# Altium schematic sheet Delay.SchDoc (part 2 of 4)
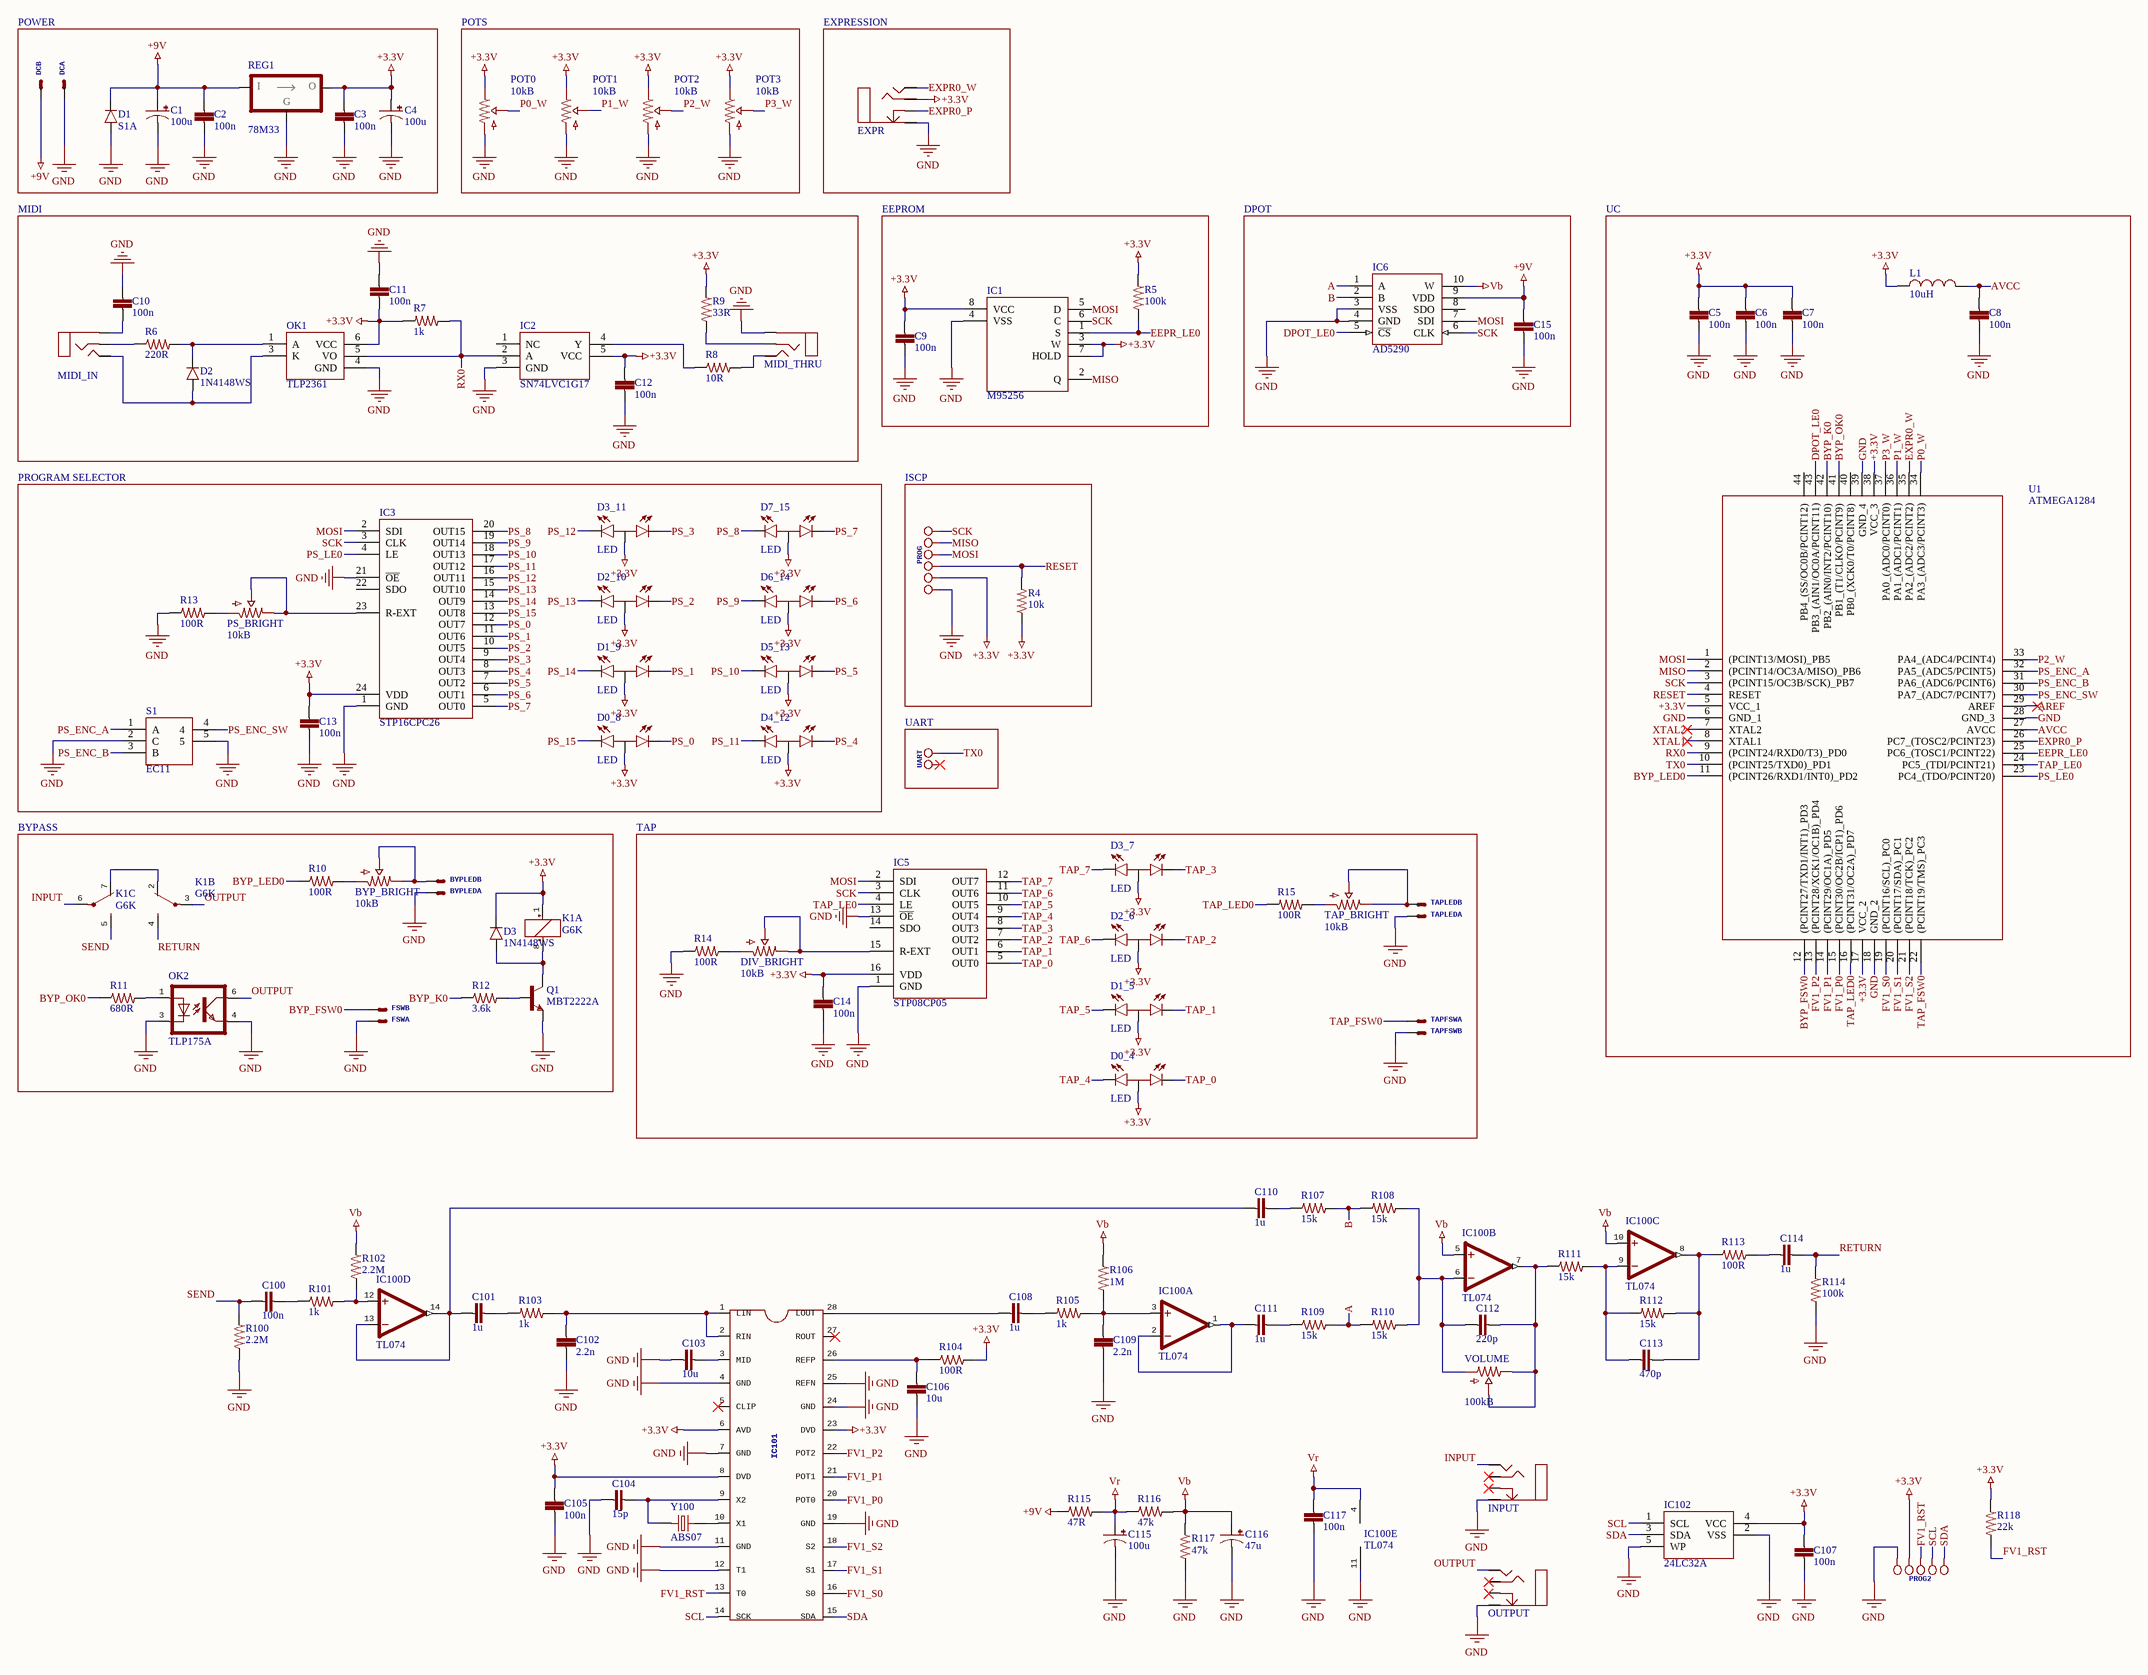
[diagram p1: Delay.SchDoc]
## Library data of the parts
BYP_BRIGHT DIV_BRIGHT PS_BRIGHT TAP_BRIGHT = TRIM_10kB_3362P: 10k Lin 3362P trimmer; Price: 0.1
BYPLED FSW TAPFSW TAPLED = JST-XH-02: 2 Pins male XH header; Price: 0.1
C1 C4 C115 = MCVVT025M101EA6L: CAP ALUM 100UF 25V SMD; Manufacturer: Multicomp; Life (Hours): 2000Hour; Ripple Current (AC): 6.3mA; Supplier 1: Farnell; Supplier Part Number 1: 2611370; Manufacturer Part Number: MCVVT025M101EA6L; Stock: 1063; Pricing: 1=0.157, 50=0.104, 100=0.0932, 250=0.0801, 500=0.0681 (EUR); RoHS: No; Min Operating Temperature: -55°C; Max Operating Temperature: 105°C; Capacitance: 100uF; Voltage Rating: 25V; Packaging: Tape and Reel; Voltage Rating (DC): 25V; Diameter: 6.3mm; Height: 7.7mm; REACH SVHC: No SVHC; ComponentLink1URL: http://www.farnell.com/datasheets/2151198.pdf?src-supplier=Element14; ComponentLink1Description: http://www.farnell.com/datasheets/2151198.pdf?src-supplier=Element14; Price: 0.102
C2 C3 C5-C15 C105 C107 C117 = MC0603B104K500CT: CAP CER 100NF 50V X7R 0603; Manufacturer: Multicomp; Tolerance: 10%; Supplier 1: Farnell; Supplier Part Number 1: 1759122; Manufacturer Part Number: MC0603B104K500CT; Stock 1: 1057763; RoHS: Yes; Case/Package: 0603; Number of Pins: 2; Case Code (Metric): 1608; Case Code (Imperial): 0603; Min Operating Temperature: -55°C; Max Operating Temperature: 125°C; Packaging: Cut Tape; Voltage Rating: 50V; Capacitance: 100nF; Dielectric: X7R; Voltage Rating (DC): 50V; REACH SVHC: Unknown; ComponentLink1URL: https://datasheet.ciiva.com/22686/1901289-22686278.pdf?src-supplier=Element14; ComponentLink1Description: https://datasheet.ciiva.com/22686/1901289-22686278.pdf?src-supplier=Element14; ComponentLink2URL: https://datasheet.ciiva.com/22686/1901289-22686279.pdf?src-supplier=Element14; ComponentLink2Description: https://datasheet.ciiva.com/22686/1901289-22686279.pdf?src-supplier=Element14; ComponentLink3URL: https://datasheet.ciiva.com/22648/1901289-22648411.pdf?src-supplier=Element14; ComponentLink3Description: https://datasheet.ciiva.com/22648/1901289-22648411.pdf?src-supplier=Element14; Price: 0.0458
C100 = GRM31C5C1H104JA01L: CAP CER 100NF 50V C0G/NP0 1206; Manufacturer: Murata; Material: Ceramic; Tolerance: 5%; Dielectric: C0G; Temperature Coefficient: 30ppm/°C; Supplier 1: Farnell; Supplier Part Number 1: 2494294; Manufacturer Part Number: GRM31C5C1H104JA01L; Stock 1: 206865; Pricing 1: 5 = 0.62500, 50 = 0.31000, 250 = 0.29700, 500 = 0.22200, 1000 = 0.18900 (EUR); RoHS: Yes; Mount: Surface Mount; Case/Package: 1206; Weight: 0.000571oz; Case Code (Metric): 3216; Case Code (Imperial): 1206; Min Operating Temperature: -55°C; Max Operating Temperature: 125°C; Capacitance: 100nF; Packaging: Tape and Reel; Package Quantity: 1; Voltage Rating: 50V; Voltage Rating (DC): 50V; Termination: SMD/SMT; Voltage: 50V; Length: 3.2mm; Height: 1.6mm; Width: 0.063inch; Thickness: 0.071inch; Depth: 1.6mm; Radiation Hardening: No; REACH SVHC: No SVHC; Lead Free: Lead Free; ComponentLink1URL: https://datasheet.ciiva.com/11618/product-11618880.pdf?src-supplier=Avnet; ComponentLink1Description: https://datasheet.ciiva.com/11618/product-11618880.pdf?src-supplier=Avnet; ComponentLink2URL: https://datasheet.ciiva.com/29200/453430-da-01-en-vs-kondensator-1206-29200201.pdf?src-supplier=Conrad; ComponentLink2Description: https://datasheet.ciiva.com/29200/453430-da-01-en-vs-kondensator-1206-29200201.pdf?src-supplier=Conrad; ComponentLink3URL: https://datasheet.ciiva.com/5420/product-5420070.pdf?src-supplier=Mouser; ComponentLink3Description: https://datasheet.ciiva.com/5420/product-5420070.pdf?src-supplier=Mouser; ComponentLink4URL: https://datasheet.ciiva.com/16461/product-16461275.pdf?src-supplier=Future+Electronics; ComponentLink4Description: https://datasheet.ciiva.com/16461/product-16461275.pdf?src-supplier=Future+Electronics; ComponentLink5URL: https://datasheet.ciiva.com/6270/partnumbering-e-01-6270255.pdf?src-supplier=Digi-Key; ComponentLink5Description: https://datasheet.ciiva.com/6270/partnumbering-e-01-6270255.pdf?src-supplier=Digi-Key; Price: 0.31
C101 C108 C110 C111 C114 = ECP-U1C105MA5: CAP FILM 1UF 16V 20%; Manufacturer: Panasonic; Dielectric: PPS; Dissipation Factor: 1.5%; Insulation Resistance: 300MR; Supplier 1: Farnell; Supplier Part Number 1: 9694315; Manufacturer Part Number: ECP-U1C105MA5; RoHS: Yes; Category: Film Capacitors; Stock: 7744; Pricing: 5=0.65900, 50=0.39900, 250=0.33300, 500=0.27300, 1000=0.26400 (EUR); Mount: Surface Mount; Case/Package: 1210; Number of Pins: 2; Case Code (Metric): 3225; Contact Plating: Copper,Tin,Silver; Case Code (Imperial): 1210; Min Operating Temperature: -40°C; Max Operating Temperature: 85°C; Capacitance: 1uF; Tolerance: 20%; Termination: SMD/SMT; Voltage: 16V; Packaging: Tape and Reel; Package Quantity: 1; Voltage Rating: 16V; Voltage Rating (DC): 16V; Length: 3.2mm; Height: 1.4mm; Depth: 2.5mm; Height - Seated (Max): 0.063inch; Width: 2.5mm; Radiation Hardening: No; Lead Free: Lead Free; REACH SVHC: No SVHC; ComponentLink1URL: https://datasheet.ciiva.com/24023/abd0000ce12-181823-24023616.pdf?src-supplier=Mouser; ComponentLink1Description: https://datasheet.ciiva.com/24023/abd0000ce12-181823-24023616.pdf?src-supplier=Mouser; ComponentLink2URL: https://datasheet.ciiva.com/34303/1983192-34303533.pdf?src-supplier=Jameco; ComponentLink2Description: https://datasheet.ciiva.com/34303/1983192-34303533.pdf?src-supplier=Jameco; ComponentLink3URL: https://datasheet.ciiva.com/11790/0900766b80f2ea72-11790686.pdf?src-supplier=RSComponents; ComponentLink3Description: https://datasheet.ciiva.com/11790/0900766b80f2ea72-11790686.pdf?src-supplier=RSComponents; ComponentLink4URL: https://datasheet.ciiva.com/2992/abd0000ce12-2992994.pdf?src-supplier=Avnet; ComponentLink4Description: https://datasheet.ciiva.com/2992/abd0000ce12-2992994.pdf?src-supplier=Avnet; ComponentLink5URL: https://datasheet.ciiva.com/2992/abd0000ce12-2992995.pdf?src-supplier=Avnet; ComponentLink5Description: https://datasheet.ciiva.com/2992/abd0000ce12-2992995.pdf?src-supplier=Avnet; ComponentLink6URL: https://datasheet.ciiva.com/46399/31740-46399788.pdf?src-supplier=Element14; ComponentLink6Description: https://datasheet.ciiva.com/46399/31740-46399788.pdf?src-supplier=Element14; ComponentLink7URL: https://datasheet.ciiva.com/16433/abd0000ce12-16433502.pdf?src-supplier=Future+Electronics; ComponentLink7Description: https://datasheet.ciiva.com/16433/abd0000ce12-16433502.pdf?src-supplier=Future+Electronics; ComponentLink8URL: https://datasheet.ciiva.com/5710/31740-5710134.pdf?src-supplier=Farnell; ComponentLink8Description: https://datasheet.ciiva.com/5710/31740-5710134.pdf?src-supplier=Farnell; ComponentLink9URL: https://datasheet.ciiva.com/30120/abd0000ce12-30120298.pdf?src-supplier=Onlinecomponents.com; ComponentLink9Description: https://datasheet.ciiva.com/30120/abd0000ce12-30120298.pdf?src-supplier=Onlinecomponents.com; ComponentLink10URL: https://datasheet.ciiva.com/46399/31740-46399787.pdf?src-supplier=Element14; ComponentLink10Description: https://datasheet.ciiva.com/46399/31740-46399787.pdf?src-supplier=Element14; ComponentLink11URL: https://datasheet.ciiva.com/15164/getdatasheetpartid-292104-15164029.pdf?src-supplier=Verical; ComponentLink11Description: https://datasheet.ciiva.com/15164/getdatasheetpartid-292104-15164029.pdf?src-supplier=Verical
C102 C109 = GRM1885C1H222JA01D: CAP CER 2.2NF 50V C0G/NP0 0603; Manufacturer: Murata; Material: Ceramic; Tolerance: 5%; Dielectric: C0G; Insulation Resistance: 10GR; Temperature Coefficient: 30ppm/°C; Supplier 1: Farnell; Supplier Part Number 1: 8819947; Manufacturer Part Number: GRM1885C1H222JA01D; Stock 1: 81117; Pricing 1: 10 = 0.11000, 100 = 0.05180, 500 = 0.04100, 1000 = 0.03510, 2000 = 0.03080 (EUR); RoHS: Yes; Mount: Surface Mount; Case/Package: 0603; Number of Pins: 2; Case Code (Imperial): 0603; Case Code (Metric): 1608; Dielectric Material: Ceramic; Min Operating Temperature: -55°C; Max Operating Temperature: 125°C; Capacitance: 2.2nF; Packaging: Tape and Reel; Voltage Rating: 50V; Voltage Rating (DC): 50V; Package Quantity: 1; Termination: SMD/SMT; Voltage: 50V; Length: 1.6mm; Height: 0.8mm; Width: 0.8mm; Thickness: 0.035inch; Depth: 0.8mm; Radiation Hardening: No; REACH SVHC: No SVHC; Lead Free: Lead Free; ComponentLink1URL: https://datasheet.ciiva.com/11786/0900766b807a1cab-11786840.pdf?src-supplier=RSComponents; ComponentLink1Description: https://datasheet.ciiva.com/11786/0900766b807a1cab-11786840.pdf?src-supplier=RSComponents; ComponentLink2URL: https://datasheet.ciiva.com/3777/1632grm1885c1h222ja0123-3777835.pdf?src-supplier=Arrow; ComponentLink2Description: https://datasheet.ciiva.com/3777/1632grm1885c1h222ja0123-3777835.pdf?src-supplier=Arrow; ComponentLink3URL: https://datasheet.ciiva.com/2989/product-2989459.pdf?src-supplier=Avnet; ComponentLink3Description: https://datasheet.ciiva.com/2989/product-2989459.pdf?src-supplier=Avnet; ComponentLink4URL: https://datasheet.ciiva.com/6031/4360-6031797.pdf?src-supplier=Farnell; ComponentLink4Description: https://datasheet.ciiva.com/6031/4360-6031797.pdf?src-supplier=Farnell; ComponentLink5URL: https://datasheet.ciiva.com/7828/4360-7828918.pdf?src-supplier=Element14; ComponentLink5Description: https://datasheet.ciiva.com/7828/4360-7828918.pdf?src-supplier=Element14; ComponentLink6URL: https://datasheet.ciiva.com/11463/product-11463974.pdf?src-supplier=Avnet; ComponentLink6Description: https://datasheet.ciiva.com/11463/product-11463974.pdf?src-supplier=Avnet; ComponentLink7URL: https://datasheet.ciiva.com/16624/product-16624150.pdf?src-supplier=Avnet+Europe; ComponentLink7Description: https://datasheet.ciiva.com/16624/product-16624150.pdf?src-supplier=Avnet+Europe; ComponentLink8URL: https://datasheet.ciiva.com/7828/1747455-7828919.pdf?src-supplier=Element14; ComponentLink8Description: https://datasheet.ciiva.com/7828/1747455-7828919.pdf?src-supplier=Element14; ComponentLink9URL: https://datasheet.ciiva.com/133/partnumbering-e-01-133576.pdf?src-supplier=Digi-Key; ComponentLink9Description: https://datasheet.ciiva.com/133/partnumbering-e-01-133576.pdf?src-supplier=Digi-Key; ComponentLink10URL: https://datasheet.ciiva.com/7828/1747455-7828920.pdf?src-supplier=Element14; ComponentLink10Description: https://datasheet.ciiva.com/7828/1747455-7828920.pdf?src-supplier=Element14; ComponentLink11URL: https://datasheet.ciiva.com/133/partnumbering-e-01-133577.pdf?src-supplier=Digi-Key; ComponentLink11Description: https://datasheet.ciiva.com/133/partnumbering-e-01-133577.pdf?src-supplier=Digi-Key; ComponentLink12URL: https://datasheet.ciiva.com/133/partnumbering-e-01-133578.pdf?src-supplier=Digi-Key; ComponentLink12Description: https://datasheet.ciiva.com/133/partnumbering-e-01-133578.pdf?src-supplier=Digi-Key; ComponentLink13URL: https://datasheet.ciiva.com/29241/450664-da-01-en-vs-kondensator-0603-29241770.pdf?src-supplier=Conrad; ComponentLink13Description: https://datasheet.ciiva.com/29241/450664-da-01-en-vs-kondensator-0603-29241770.pdf?src-supplier=Conrad; Price: 0.0217
C103 C106 = TMK316B7106KL-TD: CAP CER 10uF 25V X7R 1206; Manufacturer: Taiyo Yuden; Tolerance: 10%; Supplier 1: Farnell; Supplier Part Number 1: 2113073; Manufacturer Part Number: TMK316B7106KL-TD; RoHS: Yes; Category: Ceramic Capacitors; Stock: 588931; Mount: Surface Mount; Case/Package: 1206; Number of Pins: 2; Case Code (Imperial): 1206; Case Code (Metric): 3216; Weight: 0.000571oz; Min Operating Temperature: -55°C; Max Operating Temperature: 125°C; Capacitance: 10uF; Voltage Rating: 25V; Packaging: Tape and Reel; Dielectric: X7R; Voltage Rating (DC): 25V; Package Quantity: 1; Termination: SMD/SMT; Resistor Type: Ceramic; Length: 0.126inch; Width: 1.6mm; Height: 1.6mm; Thickness: 0.071inch; REACH SVHC: Unknown; ComponentLink1URL: https://datasheet.ciiva.com/15922/582tmk316ab7106kl-t-15922403.pdf?src-supplier=Onlinecomponents.com; ComponentLink1Description: https://datasheet.ciiva.com/15922/582tmk316ab7106kl-t-15922403.pdf?src-supplier=Onlinecomponents.com; ComponentLink2URL: https://datasheet.ciiva.com/7975/1784422-7975593.pdf?src-supplier=Element14; ComponentLink2Description: https://datasheet.ciiva.com/7975/1784422-7975593.pdf?src-supplier=Element14; ComponentLink3URL: https://datasheet.ciiva.com/30123/25tmk316ab7106kl-t-30123726.pdf?src-supplier=Onlinecomponents.com; ComponentLink3Description: https://datasheet.ciiva.com/30123/25tmk316ab7106kl-t-30123726.pdf?src-supplier=Onlinecomponents.com; ComponentLink4URL: https://datasheet.ciiva.com/7975/mlcc-all-e-7975834.pdf?src-supplier=Element14; ComponentLink4Description: https://datasheet.ciiva.com/7975/mlcc-all-e-7975834.pdf?src-supplier=Element14; ComponentLink5URL: https://datasheet.ciiva.com/139/mlcc-all-e-139531.pdf?src-supplier=Digi-Key; ComponentLink5Description: https://datasheet.ciiva.com/139/mlcc-all-e-139531.pdf?src-supplier=Digi-Key; ComponentLink6URL: https://datasheet.ciiva.com/22748/1481447-22748971.pdf?src-supplier=Element14; ComponentLink6Description: https://datasheet.ciiva.com/22748/1481447-22748971.pdf?src-supplier=Element14; ComponentLink7URL: https://datasheet.ciiva.com/139/mlcc-all-e-139532.pdf?src-supplier=Digi-Key; ComponentLink7Description: https://datasheet.ciiva.com/139/mlcc-all-e-139532.pdf?src-supplier=Digi-Key; ComponentLink8URL: https://datasheet.ciiva.com/139/mlcc-all-e-139533.pdf?src-supplier=Digi-Key; ComponentLink8Description: https://datasheet.ciiva.com/139/mlcc-all-e-139533.pdf?src-supplier=Digi-Key; Price: 0.149
C104 = MC0603N150J500CT: CAP CER 15PF 50V C0G/NP0 0603; Manufacturer: Multicomp; Tolerance: 5%; Dielectric: C0G; Temperature Coefficient: 30ppm/°C; Supplier 1: Farnell; Supplier Part Number 1: 1759055; Manufacturer Part Number: MC0603N150J500CT; RoHS: Yes; Category: Ceramic Capacitors; Stock: 62089; Pricing: 10=0.04660, 100=0.03490, 500=0.02000, 1000=0.01400, 2000=0.01240 (EUR); Case/Package: 0603; Number of Pins: 2; Case Code (Metric): 1608; Case Code (Imperial): 0603; Min Operating Temperature: -55°C; Max Operating Temperature: 125°C; Capacitance: 15pF; Packaging: Tape and Reel; Voltage Rating: 50V; Voltage Rating (DC): 50V; Width: 0.8mm; REACH SVHC: Unknown; ComponentLink1URL: https://datasheet.ciiva.com/22675/1901289-22675815.pdf?src-supplier=Element14; ComponentLink1Description: https://datasheet.ciiva.com/22675/1901289-22675815.pdf?src-supplier=Element14; ComponentLink2URL: https://datasheet.ciiva.com/22675/1901289-22675816.pdf?src-supplier=Element14; ComponentLink2Description: https://datasheet.ciiva.com/22675/1901289-22675816.pdf?src-supplier=Element14; ComponentLink3URL: https://datasheet.ciiva.com/22648/1901289-22648477.pdf?src-supplier=Element14; ComponentLink3Description: https://datasheet.ciiva.com/22648/1901289-22648477.pdf?src-supplier=Element14; Price: 0.0356
C112 = MC0603N221J500CT: CAP CER 220PF 50V C0G/NP0 0603; Manufacturer: Multicomp; Tolerance: 5%; Dielectric: C0G; Supplier 1: Farnell; Supplier Part Number 1: 1759071; Manufacturer Part Number: MC0603N221J500CT; Stock: 17812; Pricing: 10=0.027, 100=0.0219, 500=0.0135, 1000=0.0107, 2000=0.0098 (EUR); RoHS: Yes; Case/Package: 0603; Number of Pins: 2; Case Code (Metric): 1608; Case Code (Imperial): 0603; Min Operating Temperature: -55°C; Max Operating Temperature: 125°C; Capacitance: 220pF; Packaging: Cut Tape; Voltage Rating: 50V; Voltage Rating (DC): 50V; REACH SVHC: Unknown; ComponentLink1URL: https://datasheet.ciiva.com/22648/1901289-22648489.pdf?src-supplier=Element14; ComponentLink1Description: https://datasheet.ciiva.com/22648/1901289-22648489.pdf?src-supplier=Element14; ComponentLink2URL: https://datasheet.ciiva.com/22675/1901289-22675354.pdf?src-supplier=Element14; ComponentLink2Description: https://datasheet.ciiva.com/22675/1901289-22675354.pdf?src-supplier=Element14; ComponentLink3URL: https://datasheet.ciiva.com/22675/1901289-22675355.pdf?src-supplier=Element14; ComponentLink3Description: https://datasheet.ciiva.com/22675/1901289-22675355.pdf?src-supplier=Element14; Price: 0.0192
C113 = MC0603N471J500CT: CAP CER 470PF 50V C0G/NP0 0603; Manufacturer: Multicomp; Tolerance: 5%; Dielectric: C0G; Temperature Coefficient: 30ppm/°C; Supplier 1: Farnell; Supplier Part Number 1: 1759080; Manufacturer Part Number: MC0603N471J500CT; Stock: 33267; Pricing: 10=0.0522, 100=0.0354, 500=0.0206, 1000=0.0189, 2000=0.0171 (EUR); RoHS: Yes; Case/Package: 0603; Number of Pins: 2; Case Code (Metric): 1608; Case Code (Imperial): 0603; Min Operating Temperature: -55°C; Max Operating Temperature: 125°C; Capacitance: 470pF; Voltage Rating: 50V; Packaging: Cut Tape; Voltage Rating (DC): 50V; Width: 0.8mm; REACH SVHC: Unknown; ComponentLink1URL: https://datasheet.ciiva.com/22648/1901289-22648504.pdf?src-supplier=Element14; ComponentLink1Description: https://datasheet.ciiva.com/22648/1901289-22648504.pdf?src-supplier=Element14; ComponentLink2URL: https://datasheet.ciiva.com/22675/1901289-22675320.pdf?src-supplier=Element14; ComponentLink2Description: https://datasheet.ciiva.com/22675/1901289-22675320.pdf?src-supplier=Element14; ComponentLink3URL: https://datasheet.ciiva.com/22648/1901289-22648505.pdf?src-supplier=Element14; ComponentLink3Description: https://datasheet.ciiva.com/22648/1901289-22648505.pdf?src-supplier=Element14; Price: 0.035
C116 = MCVVT025M470EA1L: CAP ALUM 47UF 25V SMD; Manufacturer: Multicomp; Life (Hours): 2000Hour; Ripple Current (AC): 6.3mA; Supplier 1: Farnell; Supplier Part Number 1: 2611377; Manufacturer Part Number: MCVVT025M470EA1L; Stock: 1436; Pricing: 1=0.125, 50=0.0825, 100=0.0741, 250=0.0637, 500=0.0542 (EUR); RoHS: No; Min Operating Temperature: -55°C; Max Operating Temperature: 105°C; Capacitance: 47uF; Voltage Rating: 25V; Packaging: Cut Tape; Voltage Rating (DC): 25V; Diameter: 6.3mm; Height: 5.4mm; REACH SVHC: No SVHC; ComponentLink1URL: http://www.farnell.com/datasheets/2151198.pdf?src-supplier=Farnell; ComponentLink1Description: http://www.farnell.com/datasheets/2151198.pdf?src-supplier=Farnell; ComponentLink2URL: http://www.farnell.com/datasheets/2151198.pdf?src-supplier=Element14; ComponentLink2Description: http://www.farnell.com/datasheets/2151198.pdf?src-supplier=Element14; Price: 0.0825
D0_4 D0_8 D1_5 D1_9 D2_6 D2_10 D3_7 D3_11 D4_12 D5_13 D6_14 D7_15 = D_BICOLOR_LED: BICOLOR LED
D1 = S1A: DIODE GEN PURP 50V 1A SMA; Manufacturer: ON Semiconductor / Fairchild; Peak Reverse Current: 1uA; Max Surge Current: 40A; Forward Voltage: 1.1V; Peak Non-Repetitive Surge Current: 30A; Element Configuration: Single; Capacitance: 12pF; Recovery Time: 1800ns; Reverse Recovery Time: 1.8us; Polarity: Standard; Power Dissipation: 1.4W; Supplier 1: Farnell; Supplier Part Number 1: 9843868; Manufacturer Part Number: S1A; Stock: 34555; Pricing: 5=0.184, 25=0.179, 100=0.0727, 250=0.0669, 500=0.0667, 1000=0.0364, 5000=0.0293 (EUR); RoHS: Yes; Mount: Surface Mount; Case/Package: SMA; Number of Pins: 2; Weight: 0.106g; Contact Plating: Tin; Min Operating Temperature: -55°C; Max Operating Temperature: 150°C; Packaging: Tape and Reel; Package Quantity: 1; Voltage Rating (DC): 50V; Current Rating: 1A; Output Current: 1A; Forward Current: 1A; Max Repetitive Reverse Voltage (Vrrm): 50V; Average Rectified Current: 1A; Max Forward Surge Current (Ifsm): 30A; Max Reverse Voltage (DC): 50V; Reverse Voltage: 50V; Width: 5.28mm; Radiation Hardening: No; REACH SVHC: No SVHC; Lead Free: Lead Free; ComponentLink1URL: https://datasheet.ciiva.com/910/s1a-910480.pdf?src-supplier=Avnet; ComponentLink1Description: https://datasheet.ciiva.com/910/s1a-910480.pdf?src-supplier=Avnet; ComponentLink2URL: https://datasheet.ciiva.com/23683/1730038-23683616.pdf?src-supplier=Newark; ComponentLink2Description: https://datasheet.ciiva.com/23683/1730038-23683616.pdf?src-supplier=Newark; ComponentLink3URL: https://datasheet.ciiva.com/4452/s1a-191336-4452662.pdf?src-supplier=Mouser; ComponentLink3Description: https://datasheet.ciiva.com/4452/s1a-191336-4452662.pdf?src-supplier=Mouser; ComponentLink4URL: https://datasheet.ciiva.com/25624/0900766b80f9b629-25624903.pdf?src-supplier=RSComponents; ComponentLink4Description: https://datasheet.ciiva.com/25624/0900766b80f9b629-25624903.pdf?src-supplier=RSComponents; ComponentLink5URL: https://datasheet.ciiva.com/916/s1a-916898.pdf?src-supplier=Digi-Key; ComponentLink5Description: https://datasheet.ciiva.com/916/s1a-916898.pdf?src-supplier=Digi-Key; ComponentLink6URL: https://datasheet.ciiva.com/916/s1a-916899.pdf?src-supplier=Digi-Key; ComponentLink6Description: https://datasheet.ciiva.com/916/s1a-916899.pdf?src-supplier=Digi-Key; ComponentLink7URL: https://datasheet.ciiva.com/916/s1a-916900.pdf?src-supplier=Digi-Key; ComponentLink7Description: https://datasheet.ciiva.com/916/s1a-916900.pdf?src-supplier=Digi-Key; ComponentLink8URL: https://datasheet.ciiva.com/16800/s1a-16800103.pdf?src-supplier=Future+Electronics; ComponentLink8Description: https://datasheet.ciiva.com/16800/s1a-16800103.pdf?src-supplier=Future+Electronics; ComponentLink9URL: https://datasheet.ciiva.com/28469/1766308-28469031.pdf?src-supplier=Element14; ComponentLink9Description: https://datasheet.ciiva.com/28469/1766308-28469031.pdf?src-supplier=Element14; ComponentLink10URL: https://datasheet.ciiva.com/26231/s1k-26231832.pdf?src-supplier=Avnet+Europe; ComponentLink10Description: https://datasheet.ciiva.com/26231/s1k-26231832.pdf?src-supplier=Avnet+Europe; ComponentLink11URL: https://datasheet.ciiva.com/16474/s1k-16474283.pdf?src-supplier=Avnet+Asia; ComponentLink11Description: https://datasheet.ciiva.com/16474/s1k-16474283.pdf?src-supplier=Avnet+Asia; Price: 0.072
D2 D3 = 1N4148WS: DIODE GEN PURP 75V 150MA SOD323F; Manufacturer: ON Semiconductor / Fairchild; Element Configuration: Single; Reverse Recovery Time: 4ns; Forward Voltage: 1V; Peak Reverse Current: 5uA; Power Dissipation: 200mW; Max Forward Surge Current (Ifsm): 2A; Supplier 1: Farnell; Supplier Part Number 1: 2453269; Manufacturer Part Number: 1N4148WS; Stock: 379338; Pricing: 5=0.155, 25=0.151, 100=0.0529, 250=0.0498, 500=0.0477, 1000=0.0243, 5000=0.0193 (EUR); RoHS: Yes; Mount: Surface Mount; Number of Pins: 2; Weight: 0.0276g; Contact Plating: Tin; Min Operating Temperature: -55°C; Max Operating Temperature: 150°C; Forward Current: 150mA; Max Repetitive Reverse Voltage (Vrrm): 75V; Packaging: Tape and Reel; Package Quantity: 1; Average Rectified Current: 150mA; Max Reverse Voltage (DC): 75V; Recovery Time: 4ns; Reverse Voltage: 75V; Length: 1.8mm; Height: 1mm; Width: 1.35mm; Radiation Hardening: No; Lead Free: Lead Free; REACH SVHC: No SVHC; ComponentLink1URL: https://datasheet.ciiva.com/25968/1n914bws-25968945.pdf?src-supplier=Avnet+Europe; ComponentLink1Description: https://datasheet.ciiva.com/25968/1n914bws-25968945.pdf?src-supplier=Avnet+Europe; ComponentLink2URL: https://datasheet.ciiva.com/30479/0900766b810e1cd3-30479206.pdf?src-supplier=RSComponents; ComponentLink2Description: https://datasheet.ciiva.com/30479/0900766b810e1cd3-30479206.pdf?src-supplier=RSComponents; ComponentLink3URL: https://datasheet.ciiva.com/15208/getdatasheetpartid-127819-15208358.pdf?src-supplier=Verical; ComponentLink3Description: https://datasheet.ciiva.com/15208/getdatasheetpartid-127819-15208358.pdf?src-supplier=Verical; ComponentLink4URL: https://datasheet.ciiva.com/8300/1n914bws-8300360.pdf?src-supplier=Avnet; ComponentLink4Description: https://datasheet.ciiva.com/8300/1n914bws-8300360.pdf?src-supplier=Avnet; ComponentLink5URL: https://datasheet.ciiva.com/910/1n4148ws-910380.pdf?src-supplier=Digi-Key; ComponentLink5Description: https://datasheet.ciiva.com/910/1n4148ws-910380.pdf?src-supplier=Digi-Key; ComponentLink6URL: https://datasheet.ciiva.com/910/1n4148ws-910381.pdf?src-supplier=Digi-Key; ComponentLink6Description: https://datasheet.ciiva.com/910/1n4148ws-910381.pdf?src-supplier=Digi-Key; ComponentLink7URL: https://datasheet.ciiva.com/910/1n4148ws-910382.pdf?src-supplier=Digi-Key; ComponentLink7Description: https://datasheet.ciiva.com/910/1n4148ws-910382.pdf?src-supplier=Digi-Key; Price: 0.0521
DC = J_JST-XH-02: 2 Pins male XH header; Price: 0.1
EXPR INPUT OUTPUT = J_STEREO: 6.35mm stereo insulated socket jack PCB mounted; Price: 0.5
IC1 = M95256-WMN6P: IC EEPROM 256K SPI 20MHZ 8SO; Manufacturer: STMicroelectronics; Interface: SPI,Serial; Frequency: 5MHz; Access Time: 60ns; Density: 256Kb; Min Supply Voltage: 2.5V; Max Supply Voltage: 5.5V; Nominal Supply Current: 5mA; Supplier 1: Farnell; Supplier Part Number 1: 1099712; Manufacturer Part Number: M95256-WMN6P; RoHS: Yes; Category: EEPROM; Stock: 4109; Pricing: 1=0.63300, 50=0.55300, 100=0.49000, 250=0.48700, 500=0.48300, 1000=0.46600, 2500=0.38800, 5000=0.37200 (EUR); Mount: Surface Mount; Case/Package: SOIC; Number of Pins: 8; Contact Plating: Gold; Min Operating Temperature: -40°C; Max Operating Temperature: 85°C; Packaging: Rail/Tube; Memory Size: 256Kb; Max Frequency: 5MHz; Package Quantity: 100; Memory Type: EEPROM; Length: 5mm; Height: 1.5mm; Width: 4mm; Radiation Hardening: No; REACH SVHC: No SVHC; Lead Free: Lead Free; ComponentLink1URL: https://datasheet.ciiva.com/4859/cd00103810-224498-4859620.pdf?src-supplier=Mouser; ComponentLink1Description: https://datasheet.ciiva.com/4859/cd00103810-224498-4859620.pdf?src-supplier=Mouser; ComponentLink2URL: https://datasheet.ciiva.com/15123/getdatasheetpartid-42741-15123093.pdf?src-supplier=Verical; ComponentLink2Description: https://datasheet.ciiva.com/15123/getdatasheetpartid-42741-15123093.pdf?src-supplier=Verical; ComponentLink3URL: https://datasheet.ciiva.com/14163/m95256-w-eng-tds-14163003.pdf?src-supplier=Distrelec; ComponentLink3Description: https://datasheet.ciiva.com/14163/m95256-w-eng-tds-14163003.pdf?src-supplier=Distrelec; ComponentLink4URL: https://datasheet.ciiva.com/1905/cd00103810-1905381.pdf?src-supplier=Digi-Key; ComponentLink4Description: https://datasheet.ciiva.com/1905/cd00103810-1905381.pdf?src-supplier=Digi-Key; ComponentLink5URL: https://datasheet.ciiva.com/8055/1723939-8055206.pdf?src-supplier=Element14; ComponentLink5Description: https://datasheet.ciiva.com/8055/1723939-8055206.pdf?src-supplier=Element14; ComponentLink6URL: https://datasheet.ciiva.com/16622/cd00103810-16622983.pdf?src-supplier=Avnet+Europe; ComponentLink6Description: https://datasheet.ciiva.com/16622/cd00103810-16622983.pdf?src-supplier=Avnet+Europe; ComponentLink7URL: https://datasheet.ciiva.com/41455/001185592-da-01-en-ic-eepr-256kbit-m95256-wmn6p-soic-8-stm-41455210.pdf?src-supplier=Conrad; ComponentLink7Description: https://datasheet.ciiva.com/41455/001185592-da-01-en-ic-eepr-256kbit-m95256-wmn6p-soic-8-stm-41455210.pdf?src-supplier=Conrad; Price: 0.492
IC2 = SN74LVC1G17QDBVRQ1: Schmitt Trigger Buffer 1-CH Non-Inverting CMOS Automotive 5-Pin SOT-23 T/R; Manufacturer: Texas Instruments; Logic Function: Schmitt Trigger,Buffer; Max Supply Voltage: 5.5V; Min Supply Voltage: 1.65V; Propagation Delay: 8ns; Number of Channels: 1; Low Level Output Current: 32mA; High Level Output Current: -32mA; Turn-On Delay Time: 14ns; Quiescent Current: 20uA; Supplier 1: Farnell; Supplier Part Number 1: 2463773; Manufacturer Part Number: SN74LVC1G17QDBVRQ1; RoHS: Yes; Category: Logic Gates; Stock: 8770; Pricing: 5=0.23100, 50=0.17800, 100=0.12400, 250=0.10900, 500=0.09450, 1000=0.07980, 5000=0.07410 (EUR); Mount: Surface Mount; Case/Package: SOT-23-5; Number of Pins: 5; Min Operating Temperature: -40°C; Max Operating Temperature: 125°C; Polarity: Non-Inverting; Packaging: Tape and Reel; Package Quantity: 3000; Number of Outputs: 1; Number of Elements: 1; Number of Bits per Element: 1; Number of Bits: 1; Number of Inputs: 1; Number of Input Lines: 1; Number of Output Lines: 1; Radiation Hardening: No; REACH SVHC: No SVHC; Lead Free: Lead Free; ComponentLink1URL: https://datasheet.ciiva.com/26220/sn74lvc1g17-q1-26220672.pdf?src-supplier=Avnet+Europe; ComponentLink1Description: https://datasheet.ciiva.com/26220/sn74lvc1g17-q1-26220672.pdf?src-supplier=Avnet+Europe; ComponentLink2URL: https://datasheet.ciiva.com/6623/sn74lvc1g17-q1-6623803.pdf?src-supplier=Digi-Key; ComponentLink2Description: https://datasheet.ciiva.com/6623/sn74lvc1g17-q1-6623803.pdf?src-supplier=Digi-Key; ComponentLink3URL: https://datasheet.ciiva.com/6623/sn74lvc1g17-q1-6623805.pdf?src-supplier=Digi-Key; ComponentLink3Description: https://datasheet.ciiva.com/6623/sn74lvc1g17-q1-6623805.pdf?src-supplier=Digi-Key; ComponentLink4URL: https://datasheet.ciiva.com/14318/sces663a-14318069.pdf?src-supplier=Avnet; ComponentLink4Description: https://datasheet.ciiva.com/14318/sces663a-14318069.pdf?src-supplier=Avnet; ComponentLink5URL: https://datasheet.ciiva.com/46442/1840260-46442070.pdf?src-supplier=Element14; ComponentLink5Description: https://datasheet.ciiva.com/46442/1840260-46442070.pdf?src-supplier=Element14; ComponentLink6URL: https://datasheet.ciiva.com/6623/sn74lvc1g17-q1-6623804.pdf?src-supplier=Digi-Key; ComponentLink6Description: https://datasheet.ciiva.com/6623/sn74lvc1g17-q1-6623804.pdf?src-supplier=Digi-Key; Price: 0.165
IC3 = STP16CPC26MTR: IC LED DRIVER LIN DIM 90MA 24SO; Manufacturer: STMicroelectronics; Output Voltage: 20V; Max Supply Voltage: 5.5V; Min Supply Voltage: 3V; Number of Outputs: 16; Frequency: 30MHz; Max Supply Current: 15.3mA; Supplier 1: Farnell; Supplier Part Number 1: 2460710; Manufacturer Part Number: STP16CPC26MTR; RoHS: Yes; Category: LED Drivers; Stock: 1485; Pricing: 1=1.00000, 25=0.87800, 50=0.77600, 100=0.67400, 250=0.63500, 500=0.59600, 1000=0.50900, 2500=0.42200 (EUR); Mount: Surface Mount; Case/Package: SOIC; Number of Pins: 24; Min Operating Temperature: -40°C; Max Operating Temperature: 125°C; Packaging: Tape and Reel; Package Quantity: 1; Output Current: 90mA; Min Input Voltage: 3V; Max Input Voltage: 5.5V; Switching Frequency: 30MHz; Output Current per Channel: 90mA; Radiation Hardening: No; REACH SVHC: No SVHC; Lead Free: Lead Free; ComponentLink1URL: https://datasheet.ciiva.com/41458/001184648-da-01-en-ic-led-sink-dv-stp16cpc26mtr-soic-24-stm-41458200.pdf?src-supplier=Conrad; ComponentLink1Description: https://datasheet.ciiva.com/41458/001184648-da-01-en-ic-led-sink-dv-stp16cpc26mtr-soic-24-stm-41458200.pdf?src-supplier=Conrad; ComponentLink2URL: https://datasheet.ciiva.com/1947/cd00298756-1947651.pdf?src-supplier=Digi-Key; ComponentLink2Description: https://datasheet.ciiva.com/1947/cd00298756-1947651.pdf?src-supplier=Digi-Key; ComponentLink3URL: https://datasheet.ciiva.com/1947/cd00298756-1947652.pdf?src-supplier=Digi-Key; ComponentLink3Description: https://datasheet.ciiva.com/1947/cd00298756-1947652.pdf?src-supplier=Digi-Key; ComponentLink4URL: https://datasheet.ciiva.com/1947/cd00298756-1947653.pdf?src-supplier=Digi-Key; ComponentLink4Description: https://datasheet.ciiva.com/1947/cd00298756-1947653.pdf?src-supplier=Digi-Key; ComponentLink5URL: https://datasheet.ciiva.com/16491/cd00298756-16491784.pdf?src-supplier=Future+Electronics; ComponentLink5Description: https://datasheet.ciiva.com/16491/cd00298756-16491784.pdf?src-supplier=Future+Electronics; ComponentLink6URL: https://datasheet.ciiva.com/3165/cd00298756-3165289.pdf?src-supplier=Avnet; ComponentLink6Description: https://datasheet.ciiva.com/3165/cd00298756-3165289.pdf?src-supplier=Avnet; ComponentLink7URL: https://datasheet.ciiva.com/17015/cd00298756-17015228.pdf?src-supplier=Avnet+Europe; ComponentLink7Description: https://datasheet.ciiva.com/17015/cd00298756-17015228.pdf?src-supplier=Avnet+Europe; Price: 1.09
IC5 = STP08CP05MTR: IC SHIFT REGISTER 8BIT 16SOIC; Manufacturer: STMicroelectronics; Max Supply Voltage: 5.5V; Min Supply Voltage: 3V; Number of Outputs: 8; Number of Elements: 1; Propagation Delay: 28ns; Nominal Supply Current: 13.5mA; Output Voltage: 20V; Number of Output Lines: 9; Output Current per Channel: 100mA; Switching Frequency: 30MHz; Supplier 1: Farnell; Supplier Part Number 1: 2460704; Manufacturer Part Number: STP08CP05MTR; RoHS: Yes; Category: Shift Registers; Stock: 5551; Pricing: 1=0.78800, 50=0.68900, 100=0.44400, 250=0.41500, 500=0.38500, 1000=0.35600, 2500=0.30100, 5000=0.28900 (EUR); Mount: Surface Mount; Case/Package: SO; Number of Pins: 16; Contact Plating: Gold; Min Operating Temperature: -40°C; Max Operating Temperature: 125°C; Packaging: Tape and Reel; Package Quantity: 1; Number of Bits per Element: 8; Logic Function: Shift Register; Number of Circuits: 1; Number of Input Lines: 1; Output Current: 100mA; Min Input Voltage: 3V; Max Input Voltage: 5.5V; Radiation Hardening: No; Lead Free: Lead Free; REACH SVHC: No SVHC; ComponentLink1URL: https://datasheet.ciiva.com/26807/getdatasheetpartid-50603-26807446.pdf?src-supplier=Verical; ComponentLink1Description: https://datasheet.ciiva.com/26807/getdatasheetpartid-50603-26807446.pdf?src-supplier=Verical; ComponentLink2URL: https://datasheet.ciiva.com/41455/001185564-da-01-en-ic-shift-regist-stp08cp05mtr-soic-16-stm-41455644.pdf?src-supplier=Conrad; ComponentLink2Description: https://datasheet.ciiva.com/41455/001185564-da-01-en-ic-shift-regist-stp08cp05mtr-soic-16-stm-41455644.pdf?src-supplier=Conrad; ComponentLink3URL: https://datasheet.ciiva.com/16491/cd00160230-16491197.pdf?src-supplier=Future+Electronics; ComponentLink3Description: https://datasheet.ciiva.com/16491/cd00160230-16491197.pdf?src-supplier=Future+Electronics; Price: 0.837
IC6 = AD5290YRMZ10: DIGIPOT 8BIT 10K, SMD, 5290, MSOP10; Manufacturer: Analog Devices; Resistance: 10kR; Memory Type: Volatile; Number of Positions: 256; Interface: SPI; Min Supply Voltage: 20V; Max Supply Voltage: 30V; Number of Elements: 1; Tolerance: 30%; Nominal Supply Current: 15uA; Min Dual Supply Voltage: 10V; Max Dual Supply Voltage: 15V; Temperature Coefficient: 35ppm/°C; Frequency: 4MHz; -3db Bandwidth: 470Hz; Voltage: 35V; Supplier 1: Farnell; Supplier Part Number 1: 1274278; Manufacturer Part Number: AD5290YRMZ10; RoHS: Yes; Category: Digital Potentiometers; Stock: 199; Pricing: 1=5.36000, 10=4.31000, 25=3.90000, 50=3.71000, 100=3.55000, 250=3.20000, 500=2.75000 (EUR); Mount: Surface Mount; Case/Package: MSOP; Number of Pins: 10; Contact Plating: Tin,Matte; Min Operating Temperature: -40°C; Max Operating Temperature: 125°C; Packaging: Rail/Tube; Package Quantity: 50; Taper: Linear; Number of Circuits: 1; Number of Taps: 256; Operating Supply Current: 15uA; Max Supply Current: 15uA; Length: 3mm; Height: 0.85mm; Width: 3mm; Radiation Hardening: No; Lead Free: Contains Lead; REACH SVHC: No SVHC; ComponentLink1URL: https://datasheet.ciiva.com/1145/1519523-1145622.pdf?src-supplier=Element14; ComponentLink1Description: https://datasheet.ciiva.com/1145/1519523-1145622.pdf?src-supplier=Element14; ComponentLink2URL: https://datasheet.ciiva.com/25918/ad5290-25918522.pdf?src-supplier=Avnet+Europe; ComponentLink2Description: https://datasheet.ciiva.com/25918/ad5290-25918522.pdf?src-supplier=Avnet+Europe; ComponentLink3URL: https://datasheet.ciiva.com/1331/ad5290-1331012.pdf?src-supplier=Digi-Key; ComponentLink3Description: https://datasheet.ciiva.com/1331/ad5290-1331012.pdf?src-supplier=Digi-Key; ComponentLink4URL: https://datasheet.ciiva.com/16471/ad5290-16471686.pdf?src-supplier=Avnet+Asia; ComponentLink4Description: https://datasheet.ciiva.com/16471/ad5290-16471686.pdf?src-supplier=Avnet+Asia; ComponentLink5URL: https://datasheet.ciiva.com/3045/ad5290-3045389.pdf?src-supplier=Avnet; ComponentLink5Description: https://datasheet.ciiva.com/3045/ad5290-3045389.pdf?src-supplier=Avnet; Price: 4.93
IC100 = TL074IDT: IC OPAMP JFET 3MHZ 14SO; Manufacturer: STMicroelectronics; Voltage Gain: 106.02dB; Min Dual Supply Voltage: 3V; Common Mode Rejection Ratio: 80dB; Dual Supply Voltage: 9V; Slew Rate: 13V/µs; Number of Channels: 4; Max Dual Supply Voltage: 18V; Nominal Supply Current: 2.5mA; Input Bias Current: 200pA; Input Offset Voltage (Vos): 3mV; Operating Supply Current: 1.4mA; Min Supply Voltage: 6V; Output Current: 40mA; Max Input Voltage: 15V; Min Input Voltage: -12V; Power Dissipation: 680mW; Supplier 1: Farnell; Supplier Part Number 1: 1750154; Manufacturer Part Number: TL074IDT; RoHS: Yes; Category: Amplifiers - Op Amps, Buffer, Instrumentation; Stock: 18824; Pricing: 5=0.48500, 50=0.42800, 100=0.26100, 500=0.23200, 1000=0.20200 (EUR); Mount: Surface Mount; Case/Package: SOIC; Number of Pins: 14; Min Operating Temperature: -40°C; Max Operating Temperature: 105°C; Gain Bandwidth Product: 3MHz; Bandwidth: 3MHz; Packaging: Tape and Reel; Unity Gain Bandwidth Product: 3MHz; Package Quantity: 2500; Number of Circuits: 4; Number of Amplifiers: 4; Number of Elements: 4; Max Supply Voltage: 18V; Output Current per Channel: 40mA; Length: 8.75mm; Height: 1.65mm; Width: 4mm; Radiation Hardening: No; REACH SVHC: No SVHC; Lead Free: Lead Free; ComponentLink1URL: https://datasheet.ciiva.com/26846/tl074idt-26846545.pdf?src-supplier=IIIC; ComponentLink1Description: https://datasheet.ciiva.com/26846/tl074idt-26846545.pdf?src-supplier=IIIC; ComponentLink2URL: https://datasheet.ciiva.com/1795/cd00000489-1795785.pdf?src-supplier=Digi-Key; ComponentLink2Description: https://datasheet.ciiva.com/1795/cd00000489-1795785.pdf?src-supplier=Digi-Key; ComponentLink3URL: https://datasheet.ciiva.com/1795/cd00000489-1795786.pdf?src-supplier=Digi-Key; ComponentLink3Description: https://datasheet.ciiva.com/1795/cd00000489-1795786.pdf?src-supplier=Digi-Key; ComponentLink4URL: https://datasheet.ciiva.com/1795/cd00000489-1795787.pdf?src-supplier=Digi-Key; ComponentLink4Description: https://datasheet.ciiva.com/1795/cd00000489-1795787.pdf?src-supplier=Digi-Key; Price: 0.349
IC101 = FV-1: Spinsemi FV-1; Package: SOIC-28; Price: 8
IC102 = 24LC32AT-I/OT: IC EEPROM 32KBIT 400KHZ SOT23-5; Manufacturer: Microchip; Interface: I2C,Serial; Access Time: 900ns; Density: 32Kb; Min Supply Voltage: 2.5V; Max Supply Voltage: 5.5V; Nominal Supply Current: 3mA; Operating Supply Voltage: 5V; Supplier 1: Farnell; Supplier Part Number 1: 1700993; Manufacturer Part Number: 24LC32AT-I/OT; RoHS: Yes; Category: EEPROM; Stock: 3287; Pricing: 1=0.29400, 10=0.29000, 25=0.28600, 50=0.27700, 100=0.26900 (EUR); Mount: Surface Mount; Case/Package: SOT-23; Number of Pins: 5; Contact Plating: Tin,Matte; Min Operating Temperature: -40°C; Max Operating Temperature: 85°C; Max Frequency: 400kHz; Frequency: 400kHz; Packaging: Tape and Reel; Package Quantity: 3000; Memory Type: EEPROM; Memory Size: 32Kb; Termination: SMD/SMT; Length: 3.1mm; Height: 1.3mm; Width: 1.8mm; Radiation Hardening: No; REACH SVHC: No SVHC; Lead Free: Lead Free; ComponentLink1URL: https://datasheet.ciiva.com/1155/1688094-1155269.pdf?src-supplier=Element14; ComponentLink1Description: https://datasheet.ciiva.com/1155/1688094-1155269.pdf?src-supplier=Element14; ComponentLink2URL: https://datasheet.ciiva.com/14134/24aa32a-24lc32a-eng-tds-14134837.pdf?src-supplier=Distrelec; ComponentLink2Description: https://datasheet.ciiva.com/14134/24aa32a-24lc32a-eng-tds-14134837.pdf?src-supplier=Distrelec; ComponentLink3URL: https://datasheet.ciiva.com/16221/filehandler-aspxddocname-en011853-16221753.pdf?src-supplier=Future+Electronics; ComponentLink3Description: https://datasheet.ciiva.com/16221/filehandler-aspxddocname-en011853-16221753.pdf?src-supplier=Future+Electronics; ComponentLink4URL: https://datasheet.ciiva.com/46410/1669362-46410953.pdf?src-supplier=Element14; ComponentLink4Description: https://datasheet.ciiva.com/46410/1669362-46410953.pdf?src-supplier=Element14; ComponentLink5URL: https://datasheet.ciiva.com/26910/getdatasheetpartid-757926-26910554.pdf?src-supplier=Verical; ComponentLink5Description: https://datasheet.ciiva.com/26910/getdatasheetpartid-757926-26910554.pdf?src-supplier=Verical; ComponentLink6URL: https://datasheet.ciiva.com/16621/21713l-16621534.pdf?src-supplier=Avnet+Europe; ComponentLink6Description: https://datasheet.ciiva.com/16621/21713l-16621534.pdf?src-supplier=Avnet+Europe; ComponentLink7URL: https://datasheet.ciiva.com/22715/1669362-22715182.pdf?src-supplier=Element14; ComponentLink7Description: https://datasheet.ciiva.com/22715/1669362-22715182.pdf?src-supplier=Element14; Price: 0.302
K1 = G6K2F3DC: OMRON ELECTRONIC COMPONENTS   G6K-2F 3DC   RELAY, SMD, DPCO, 3VDC; Contact Current Rating: 1A; Coil Resistance: 91R; Throw Configuration: DPDT; Coil Current: 33mA; Coil Voltage (DC): 3V; Operate Time: 3ms; Release Time: 1.3ms; Coil Type: Non-Latching; Coil Power: 100mW; Voltage Rating (AC): 125V; Number of Poles: 2; Contact Resistance: 100mR; Insulation Resistance: 1GR; Voltage Rating (DC): 60V; Supplier 1: Farnell; Supplier Part Number 1: 4446161; Manufacturer: Omron; Manufacturer Part Number: G6K2F3DC; RoHS: Yes; Category: Relays; Stock: 7; Pricing: 1=4.11000, 10=3.83000, 25=3.15000, 150=2.90000, 250=2.64000 (EUR); Mount: PCB,Surface Mount; Number of Pins: 8; Contact Material: Gold,Silver; Min Operating Temperature: -40°C; Max Operating Temperature: 70°C; Termination: Gull Wing; Packaging: Rail/Tube; Current Rating: 33mA; Power Rating: 100mW; Length: 10mm; Height: 5.2mm; Depth: 7.8mm; Width: 10mm; Radiation Hardening: No; REACH SVHC: Unknown; ComponentLink1URL: https://datasheet.ciiva.com/26921/getdatasheetpartid-774292-26921118.pdf?src-supplier=Verical; ComponentLink1Description: https://datasheet.ciiva.com/26921/getdatasheetpartid-774292-26921118.pdf?src-supplier=Verical; ComponentLink2URL: https://datasheet.ciiva.com/1524/15378-1524967.pdf?src-supplier=Element14; ComponentLink2Description: https://datasheet.ciiva.com/1524/15378-1524967.pdf?src-supplier=Element14; Price: 2.74
L1 = MLZ1608N100LT: TDK         MLZ1608N100LT             Surface Mount Power Inductor, Ferrite, MLZ Series, 10 H, 300 mA, 60 mA, Multilayer, 0.6 ohm                          New; Tolerance: 20%; Shielding: Shielded; DC Resistance (DCR): 780mR; Test Frequency: 2MHz; Self Resonant Frequency: 50MHz; Saturation Current: 60mA; DC Current: 300mA; Supplier 1: Farnell; Supplier Part Number 1: 2564062; Manufacturer: TDK; Manufacturer Part Number: MLZ1608N100LT; RoHS: Yes; Category: Inductors; Stock: 14993; Pricing: 10=0.12200, 100=0.07240, 500=0.06400, 1000=0.05560, 2000=0.04660, 4000=0.03890, 20000=0.03730 (EUR); Mount: Surface Mount; Case/Package: 603; Core Material: Ferrite; Min Operating Temperature: -55°C; Max Operating Temperature: 125°C; Packaging: Cut Tape; Inductance: 10uH; Inductance Tolerance: 20%; Military Standard: Not; RMS Current (Irms): 300mA; Length: 1.75mm; Depth: 0.95mm; REACH SVHC: No SVHC; ComponentLink1URL: http://www.farnell.com/datasheets/2053102.pdf?src-supplier=Farnell; ComponentLink1Description: http://www.farnell.com/datasheets/2053102.pdf?src-supplier=Farnell; ComponentLink2URL: http://components.arrow.com/part/dataview/0323_03824957?src-supplier=Arrow+Europe; ComponentLink2Description: http://components.arrow.com/part/dataview/0323_03824957?src-supplier=Arrow+Europe; ComponentLink3URL: http://www.farnell.com/datasheets/2053102.pdf?src-supplier=Element14; ComponentLink3Description: http://www.farnell.com/datasheets/2053102.pdf?src-supplier=Element14; Price: 0.077
MIDI_IN MIDI_THRU = J_STEREO_3.5: 3.5mm stereo socket jack PCB mounted; Price: 0.5
OK1 = TLP2361: TOSHIBA - TLP2361 - OPTOKOPPLER, DIGITAL, 3.75KV, SOP-5; Number of Channels: 1; Supplier 1: Farnell; Supplier Part Number 1: 2524282; Manufacturer: Toshiba; Manufacturer Part Number: TLP2361; RoHS: No; Stock: 2816; Pricing: 5=1.18000, 10=0.78500, 25=0.73300, 50=0.64500, 100=0.53800, 500=0.43200 (EUR); Case/Package: SOP; Number of Pins: 5; Isolation Voltage: 3.75kV; REACH SVHC: Unknown; ComponentLink1URL: http://www.farnell.com/datasheets/2017811.pdf?src-supplier=Farnell; ComponentLink1Description: http://www.farnell.com/datasheets/2017811.pdf?src-supplier=Farnell; ComponentLink2URL: http://www.farnell.com/datasheets/2017811.pdf?src-supplier=Element14; ComponentLink2Description: http://www.farnell.com/datasheets/2017811.pdf?src-supplier=Element14; Price: 0.73
OK2 = TLP175A: Toshiba TLP175A AC Input MOSFET Output Optocoupler, Surface Mount, 4-Pin SOIC; Isolation Voltage: 3.75kV; Max Input Current: 80mA; Number of Channels: 1; Rise Time: 1ms; Supplier 1: Farnell; Supplier Part Number 1: 2524257; Manufacturer: Toshiba; Manufacturer Part Number: TLP175A; Stock: 0; Pricing: 5=0.877, 25=0.717, 100=0.597, 250=0.546, 500=0.49, 1000=0.441 (EUR); RoHS: No; Mount: Surface Mount; Case/Package: SOIC; Number of Pins: 4; Fall Time: 1ms; REACH SVHC: Unknown; ComponentLink1URL: http://www.farnell.com/datasheets/2017792.pdf?src-supplier=Farnell; ComponentLink1Description: http://www.farnell.com/datasheets/2017792.pdf?src-supplier=Farnell; ComponentLink2URL: http://uk.rs-online.com/webdocs/129d/0900766b8129d5be.pdf?src-supplier=RSComponents; ComponentLink2Description: http://uk.rs-online.com/webdocs/129d/0900766b8129d5be.pdf?src-supplier=RSComponents; ComponentLink3URL: http://www.farnell.com/datasheets/2017792.pdf?src-supplier=Element14; ComponentLink3Description: http://www.farnell.com/datasheets/2017792.pdf?src-supplier=Element14; ComponentLink4URL: http://www.farnell.com/datasheets/2017792.pdf?src-supplier=Newark; ComponentLink4Description: http://www.farnell.com/datasheets/2017792.pdf?src-supplier=Newark; Price: 0.829
POT0-POT3 = POT_10kB_ALPHA_9mm: 10k Lin potentiometer round shaft; Price: 1.3; Dimensions: 9mm; Package: PCB Mounted
PROG = J_HEADER_6PINS_FEM: 5 Pins female header; Pin spacing: 2.54mm; Price: 0.01
PROG2 = J_HEADER_5PINS_FEM: 5 Pins female header; Pin spacing: 2.54mm; Price: 0.01
Q1 = MMBT2222AWT1G: TRANS NPN 40V 0.6A SOT323; Manufacturer: ON Semiconductor; Frequency: 300MHz; hFE Min: 35; Max Power Dissipation: 150mW; Collector Base Voltage (VCBO): 75V; Emitter Base Voltage (VEBO): 6V; Collector Emitter Saturation Voltage: 1V; Max Collector Current: 600mA; Number of Elements: 1; Element Configuration: Single; Max Frequency: 100MHz; Current Rating: 28A; Supplier 1: Farnell; Supplier Part Number 1: 2317589; Manufacturer Part Number: MMBT2222AWT1G; Stock: 16918; Pricing: 5=0.118, 50=0.114, 100=0.0413, 500=0.025, 1500=0.024 (EUR); RoHS: Yes; Case/Package: SC; Number of Pins: 3; Contact Plating: Tin; Min Operating Temperature: -55°C; Max Operating Temperature: 150°C; Package Quantity: 1; Collector Emitter Voltage (VCEO): 40V; Packaging: Tape and Reel; Polarity: NPN; Collector Emitter Breakdown Voltage: 40V; Transition Frequency: 300MHz; Power Dissipation: 150mW; Gain Bandwidth Product: 300MHz; Max Breakdown Voltage: 40V; Voltage Rating (DC): 40V; Length: 2.2mm; Height: 1mm; Width: 1.35mm; Radiation Hardening: No; Lead Free: Lead Free; REACH SVHC: No SVHC; ComponentLink1URL: https://datasheet.ciiva.com/15139/getdatasheetpartid-76779-15139056.pdf?src-supplier=Verical; ComponentLink1Description: https://datasheet.ciiva.com/15139/getdatasheetpartid-76779-15139056.pdf?src-supplier=Verical; ComponentLink2URL: https://datasheet.ciiva.com/4722/mmbt2222awt1-d-110211-4722257.pdf?src-supplier=Mouser; ComponentLink2Description: https://datasheet.ciiva.com/4722/mmbt2222awt1-d-110211-4722257.pdf?src-supplier=Mouser; ComponentLink3URL: https://datasheet.ciiva.com/16478/mmbt2222awt1-d-16478517.pdf?src-supplier=Avnet+Asia; ComponentLink3Description: https://datasheet.ciiva.com/16478/mmbt2222awt1-d-16478517.pdf?src-supplier=Avnet+Asia; ComponentLink4URL: https://datasheet.ciiva.com/11201/mmbt2222awt1-d-11201756.pdf?src-supplier=Avnet; ComponentLink4Description: https://datasheet.ciiva.com/11201/mmbt2222awt1-d-11201756.pdf?src-supplier=Avnet; ComponentLink5URL: https://datasheet.ciiva.com/16221/mmbt2222awt1-d-16221845.pdf?src-supplier=Future+Electronics; ComponentLink5Description: https://datasheet.ciiva.com/16221/mmbt2222awt1-d-16221845.pdf?src-supplier=Future+Electronics; ComponentLink6URL: https://datasheet.ciiva.com/7972/mmbt2222awt1-d-7972374.pdf?src-supplier=Element14; ComponentLink6Description: https://datasheet.ciiva.com/7972/mmbt2222awt1-d-7972374.pdf?src-supplier=Element14; ComponentLink7URL: https://datasheet.ciiva.com/22664/1708260-22664154.pdf?src-supplier=Element14; ComponentLink7Description: https://datasheet.ciiva.com/22664/1708260-22664154.pdf?src-supplier=Element14; ComponentLink8URL: https://datasheet.ciiva.com/976/mmbt2222awt1-d-976443.pdf?src-supplier=Digi-Key; ComponentLink8Description: https://datasheet.ciiva.com/976/mmbt2222awt1-d-976443.pdf?src-supplier=Digi-Key; Price: 0.0413